# EAGLE design untitled (EAGLE 9.5.2)
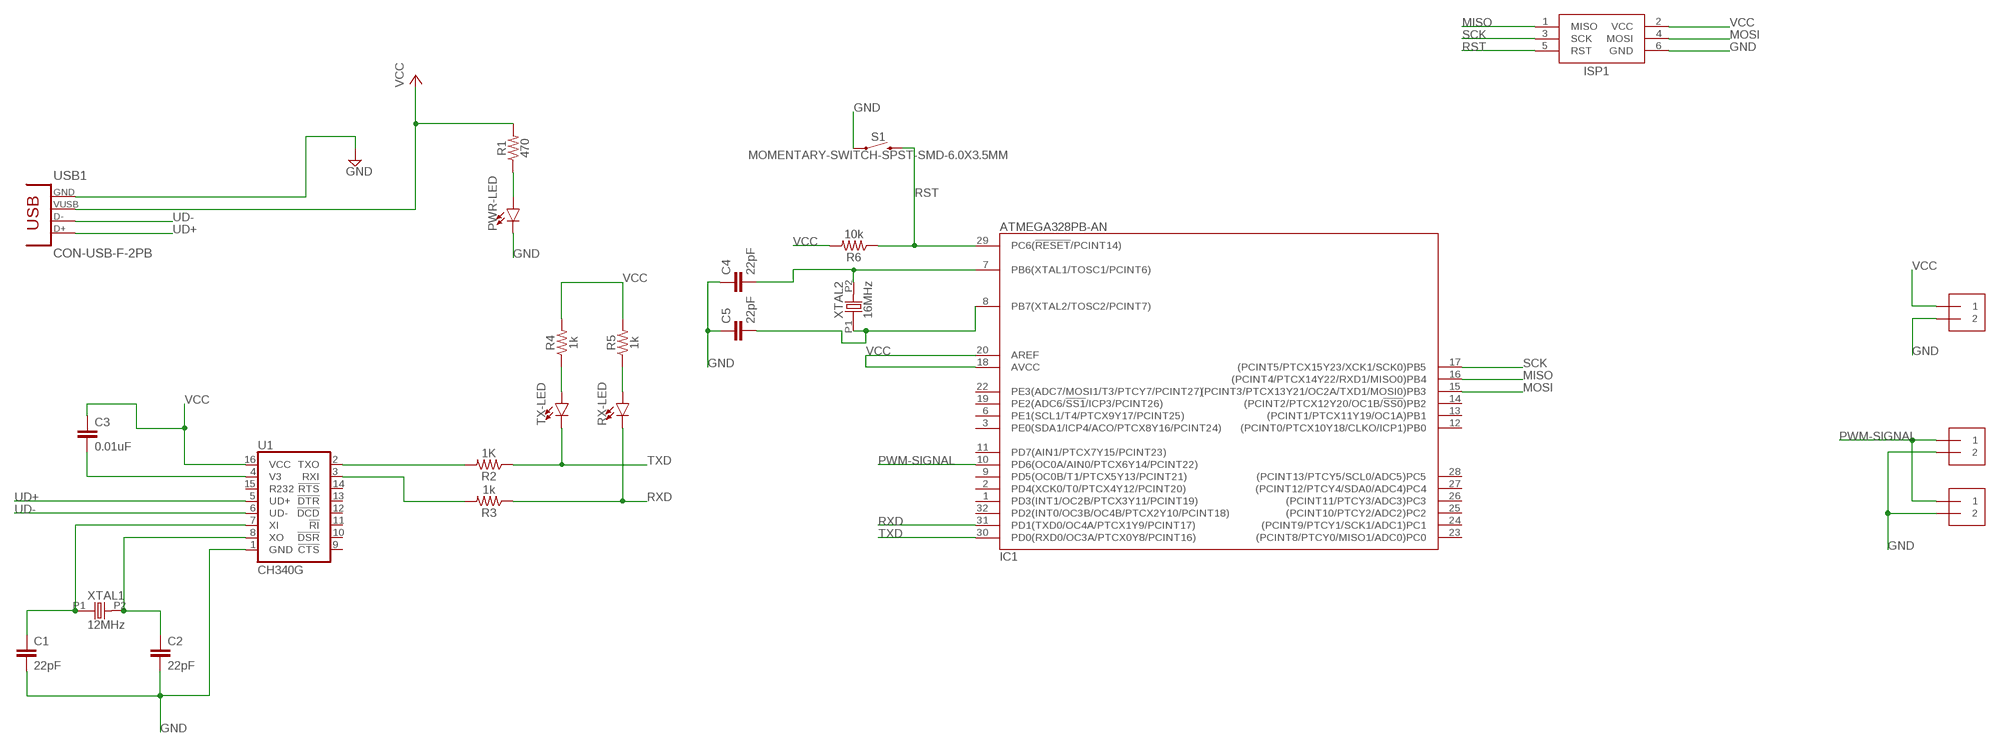
[diagram p0: schematic, sheet 1]

## Parts
5V/GND  1X2-3.5MM  [1X2-3.5MM]
C1  22pF  22PF-0603-50V-5%  [0603]
C2  22pF  22PF-0603-50V-5%  [0603]
C3  0.01uF  22PF-0603-50V-5%  [0603]
C4  22pF  22PF-0603-50V-5%  [0603]
C5  22pF  22PF-0603-50V-5%  [0603]
IC1  ATMEGA328PB-AN  [QFP32_7X7_0.80]
ISP1  AVRISP-6  [AVRISP]
MOTOR-1  1X2-3.5MM  [1X2-3.5MM]
MOTOR-2  1X2-3.5MM  [1X2-3.5MM]
PWR-LED  LED1206  [LED-1206]
R1  470  RESISTOR1206  [1206]
R2  1K  RESISTOR1206  [1206]
R3  1k  RESISTOR1206  [1206]
R4  1k  RESISTOR1206  [1206]
R5  1k  RESISTOR1206  [1206]
R6  10k  RESISTOR1206  [1206]
RX-LED  LED1206  [LED-1206]
S1  MOMENTARY-SWITCH-SPST-SMD-6.0X3.5MM  [TACTILE_SWITCH_SMD_6.0X3.5MM]
TX-LED  LED1206  [LED-1206]
U1  CH340G  CH340GSMD  [SO016]
USB1  CON-USB-F-2PB  [CONN_USB_A_F]
XTAL1  12MHz  OSC-XTAL-HC-49U-PTH  [HC-49U-PTH]
XTAL2  16MHz  OSC-XTAL-HC-49U-PTH  [HC-49U-PTH]

## Nets
GND: 5V/GND.2 C1.2 C2.2 C4.1 C5.1 ISP1.6(GND) MOTOR-1.2 MOTOR-2.2 PWR-LED.C S1.1 U1.1(GND) USB1.4(GND)
MISO: IC1.16((PCINT4/PTCX14Y22/RXD1/MISO0)PB4) ISP1.1(MISO)
MOSI: IC1.15((PCINT3/PTCX13Y21/OC2A/TXD1/MOSI0)PB3) ISP1.4(MOSI)
N$1: PWR-LED.A R1.1
N$2: C2.1 U1.8(XO) XTAL1.P2
N$3: C1.1 U1.7(XI) XTAL1.P1
N$4: C3.2 U1.4(V3)
N$5: R4.1 TX-LED.A
N$6: R2.2 U1.2(TXO)
N$7: R3.2 U1.3(RXI)
N$9: C4.2 IC1.7(PB6(XTAL1/TOSC1/PCINT6)) XTAL2.P2
N$10: C5.2 IC1.8(PB7(XTAL2/TOSC2/PCINT7)) XTAL2.P1
N$11: R5.1 RX-LED.A
PWM-SIGNAL: IC1.10(PD6(OC0A/AIN0/PTCX6Y14/PCINT22)) MOTOR-1.1 MOTOR-2.1
RST: IC1.29(PC6(!RESET!/PCINT14)) ISP1.5(RST) R6.1 S1.2
RXD: IC1.31(PD1(TXD0/OC4A/PTCX1Y9/PCINT17)) R3.1 RX-LED.C
SCK: IC1.17((PCINT5/PTCX15Y23/XCK1/SCK0)PB5) ISP1.3(SCK)
TXD: IC1.30(PD0(RXD0/OC3A/PTCX0Y8/PCINT16)) R2.1 TX-LED.C
UD+: U1.5(UD+) USB1.3(D+)
UD-: U1.6(UD-) USB1.2(D-)
VCC: 5V/GND.1 C3.1 IC1.18(AVCC) IC1.20(AREF) ISP1.2(VCC) R1.2 R4.2 R5.2 R6.2 U1.16(VCC) USB1.1(VUSB)
Unconnected: IC1.1(PD3(INT1/OC2B/PTCX3Y11/PCINT19)) IC1.2(PD4(XCK0/T0/PTCX4Y12/PCINT20)) IC1.3(PE0(SDA1/ICP4/ACO/PTCX8Y16/PCINT24)) IC1.6(PE1(SCL1/T4/PTCX9Y17/PCINT25)) IC1.9(PD5(OC0B/T1/PTCX5Y13/PCINT21)) IC1.11(PD7(AIN1/PTCX7Y15/PCINT23)) IC1.12((PCINT0/PTCX10Y18/CLKO/ICP1)PB0) IC1.13((PCINT1/PTCX11Y19/OC1A)PB1) IC1.14((PCINT2/PTCX12Y20/OC1B/!SS0!)PB2) IC1.19(PE2(ADC6/!SS1!/ICP3/PCINT26)) IC1.22(PE3(ADC7/MOSI1/T3/PTCY7/PCINT27)) IC1.23((PCINT8/PTCY0/MISO1/ADC0)PC0) IC1.24((PCINT9/PTCY1/SCK1/ADC1)PC1) IC1.25((PCINT10/PTCY2/ADC2)PC2) IC1.26((PCINT11/PTCY3/ADC3)PC3) IC1.27((PCINT12/PTCY4/SDA0/ADC4)PC4) IC1.28((PCINT13/PTCY5/SCL0/ADC5)PC5) IC1.32(PD2(INT0/OC3B/OC4B/PTCX2Y10/PCINT18)) U1.9(!CTS) U1.10(!DSR) U1.11(!RI) U1.12(!DCD) U1.13(!DTR) U1.14(!RTS) U1.15(R232) USB1.B1(BODY) USB1.B2(BODY)

## Power pins joined to a net without a drawn wire
GND: IC1.5(GND) IC1.21(GND)
VCC: IC1.4(VCC)

## Library data of the parts
5V/GND MOTOR-1 MOTOR-2 = adafruit:1X2: 3.5mm Terminal block http://www.ladyada.net/library/pcb/eaglelibrary.html
C1 C2 C4 C5 = SparkFun-Capacitors:22PF: 22pF ceramic capacitors A capacitor is a passive two-terminal electrical component used to store electrical energy temporarily in an electric field.; PROD_ID: CAP-07876
C3 = SparkFun-Capacitors:22PF: 22pF ceramic capacitors A capacitor is a passive two-terminal electrical component used to store electrical energy temporarily in an electric field.; PROD_ID: CAP-07876; VALUE: 22pF
IC1 = atmel:ATMEGA328PB: 8-bit AVR Microcontroller 32kbytes flash 2kbytes SRAM 1kbyte EEPROM USART 8-channel 10 bit ADC
ISP1 = adafruit:AVRISP: AVR ISP HEADER Standard 6 pin header for AVR programming
PWR-LED RX-LED TX-LED = SparkFun-LED:LED: LED (Generic) Standard schematic elements and footprints for 5mm, 3mm, 1206, and 0603 sized LEDs. Generic LEDs with no color specified.
R1-R6 = SparkFun-Resistors:RESISTOR: Generic Resistor Package
S1 = SparkFun-Switches:MOMENTARY-SWITCH-SPST: Momentary Switch (Pushbutton) - SPST Normally-open (NO) SPST momentary switches (buttons, pushbuttons). Variants PTH-12MM - 12mm square, through-hole Momentary Pushbutton Switch - 12mm Square <https://www.sparkfun.com/products/9190> (COM-09190) PTH-6.0MM, PTH-6.0MM-KIT - 6.0mm square, through-hole Mini Pushbutton Switch <https://www.sparkfun.com/products/97> (COM-00097) KIT package intended for soldering kit's - only one side of pads' copper is exposed. PTH-RIGHT-ANGLE-KIT - Right-angle, through-hole Right Angle Tactile Button <https://www.sparkfun.com/products/10791> - Used on SparkFun BigTime Watch Kit <https://www.sparkfun.com/products/11734> SMD-12MM - 12mm square, surface-mount Tactile Button - SMD (12mm) <https://www.sparkfun.com/products/12993> (COM-12993) Used on SparkFun PicoBoard <https://www.sparkfun.com/products/11888> SMD-4.5MM - 4.5mm Square Trackball Switch Used on SparkFun Blackberry Trackballer Breakout <https://www.sparkfun.com/products/13169> SMD-4.6MMX2.8MM - 4.60mm x 2.80mm, surface mount Used on SparkFun SAMD21 Mini Breakout <https://www.sparkfun.com/products/13664> SMD-5.2MM, SMD-5.2-REDUNDANT - 5.2mm square, surface-mount Mini Pushbutton Switch - SMD <https://www.sparkfun.com/products/8720> (COM-08720) Used on Arduino Pro Mini <https://www.sparkfun.com/products/11114> REDUNDANT package connects both switch circuits together SMD-6.0X3.5MM - 6.0 x 3.5mm, surface mount Momentary Reset Switch SMD <https://www.sparkfun.com/products/8229> (COM-08229) SMD-6.2MM-TALL - 6.2mm square, surface mount Tactile Button - SMD (6mm) <https://www.sparkfun.com/products/12992> Used on SparkFun Digital Sandbox <https://www.sparkfun.com/products/12651> SMD-RIGHT-ANGLE - Right-angle, surface mount Used on SparkFun Block for Intel® Edison - Arduino <https://www.sparkfun.com/products/13036>; PROD_ID: SWCH-14278; SF_SKU: COM-08229
U1 = SparkFun-IC-Comms:CH340G: A simple USB 2.0 to Serial IC.; PROD_ID: IC-13498
USB1 = dp_devices:CON-USB-F-2PB: USB Female connector with 2 body pins
XTAL1 XTAL2 = dp_devices:OSC-XTAL

## Board
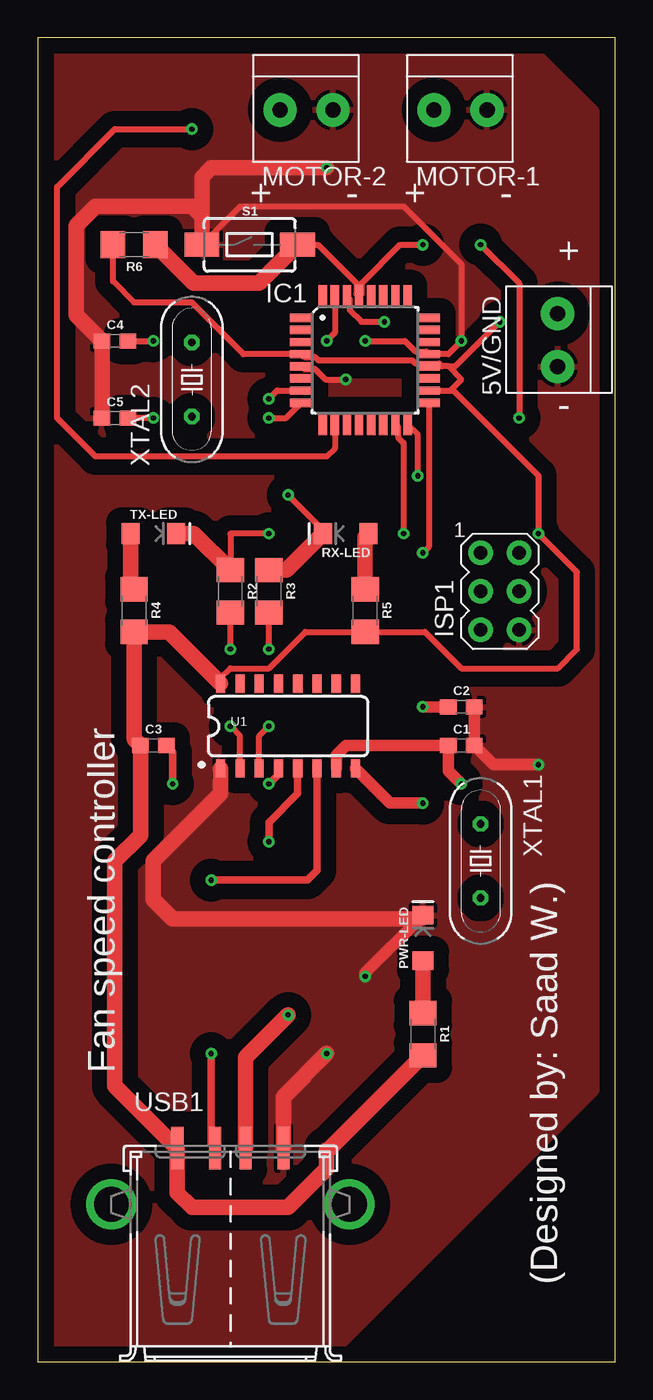
[diagram p1: board, top side]
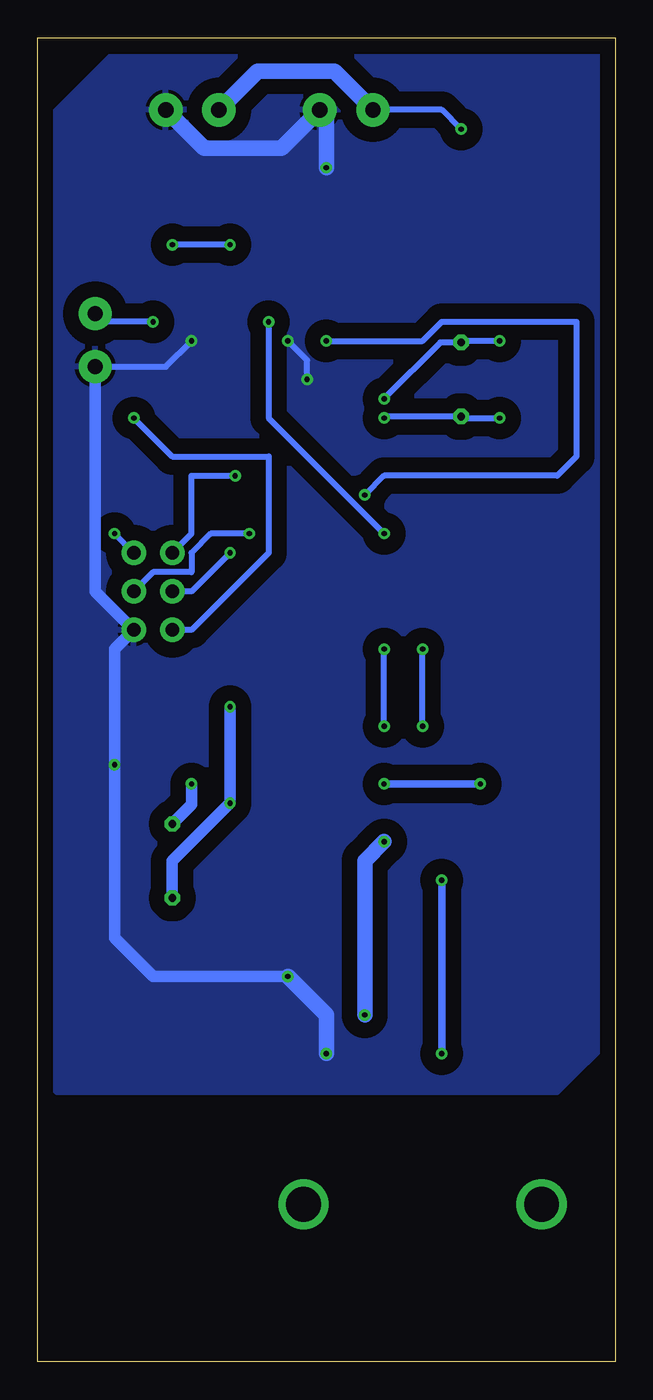
[diagram p2: board, bottom side, seen from below]

Size 38.08 x 87.3 mm. Coordinates in mm from the lower left corner, seen from the top.
Outline: 0,0 38.08,0 38.08,87.3 0,87.3 0,0
Copper layers (1*16): Top 0.035mm / dielectric 1.5mm / Bottom 0.035mm
Design rules "default": minimum track width 6mil, minimum drill 0.35mm, track to track 6mil, track to pad 6mil, pad to pad 6mil, via to via 6mil, smd to smd 6mil, copper to edge 40mil, drill to drill 6mil, minimum pad ring 10mil, minimum via ring 8mil, stop-mask expansion 4mil, vias tented up to drill 0mil, thermal gap 10mil

### Footprints (pad centres in the part's own frame; a part is rotated, then mirrored left to right if it is on the bottom)
1X2-3.5MM = drill 1 pad 2.184: 1 1.8,0; 2 -1.7,0
0603 = smd 1.1 x 1: 1 -0.85,0; 2 0.85,0
QFP32_7X7_0.80 = smd 1.5 x 0.55: 1 -4.2,2.8; 2 -4.2,2; 3 -4.2,1.2; 4 -4.2,0.4; 5 -4.2,-0.4; 6 -4.2,-1.2; 7 -4.2,-2; 8 -4.2,-2.8; 17 4.2,-2.8; 18 4.2,-2; 19 4.2,-1.2; 20 4.2,-0.4; 21 4.2,0.4; 22 4.2,1.2; 23 4.2,2; 24 4.2,2.8 | smd 0.55 x 1.5: 9 -2.8,-4.2; 10 -2,-4.2; 11 -1.2,-4.2; 12 -0.4,-4.2; 13 0.4,-4.2; 14 1.2,-4.2; 15 2,-4.2; 16 2.8,-4.2; 25 2.8,4.2; 26 2,4.2; 27 1.2,4.2; 28 0.4,4.2; 29 -0.4,4.2; 30 -1.2,4.2; 31 -2,4.2; 32 -2.8,4.2
AVRISP = drill 0.9 pad 1.626: 1 -1.27,2.54; 2 1.27,2.54; 3 -1.27,0; 4 1.27,0; 5 -1.27,-2.54; 6 1.27,-2.54
LED-1206 = smd 1.2 x 1.4: A -1.5,0; C 1.5,0
1206 = smd 1.6 x 1.8: 1 -1.4,0; 2 1.4,0
TACTILE_SWITCH_SMD_6.0X3.5MM = smd 2.3 x 1.6: 1 -3.15,0; 2 3.15,0
SO016 = smd 0.6 x 1.2: 1 -4.445,-2.8; 2 -3.175,-2.8; 3 -1.905,-2.8; 4 -0.635,-2.8; 5 0.635,-2.8; 6 1.905,-2.8; 7 3.175,-2.8; 8 4.445,-2.8; 9 4.445,2.8; 10 3.175,2.8; 11 1.905,2.8; 12 0.635,2.8; 13 -0.635,2.8; 14 -1.905,2.8; 15 -3.175,2.8; 16 -4.445,2.8
CONN_USB_A_F = smd 0.8 x 2.82: 1 -3.5,6.46; 2 -1,6.46; 3 1,6.46; 4 3.5,6.46 | drill 2.3: B1 -7.85,2.75; B2 7.85,2.75
HC-49U-PTH = drill 0.508 octagon: P1 -2.44,0; P2 2.44,0

### Placement (x,y rotation side)
5V/GND  34.29,67.31 90 top
C1  27.94,40.64 0 top
C2  27.94,43.18 0 top
C3  7.62,40.64 0 top
C4  5.08,67.31 0 top
C5  5.08,62.23 0 top
IC1  21.59,66.04 0 top
ISP1  30.48,50.8 0 top
MOTOR-1  27.94,82.55 180 top
MOTOR-2  17.78,82.55 180 top
PWR-LED  25.4,27.94 90 top
R1  25.4,21.59 270 top
R2  12.7,50.8 270 top
R3  15.24,50.8 270 top
R4  6.35,49.53 270 top
R5  21.59,49.53 270 top
R6  6.35,73.66 180 top
RX-LED  20.32,54.61 180 top
S1  13.97,73.66 0 top
TX-LED  7.62,54.61 0 top
U1  16.51,41.91 0 top
USB1  12.7,7.62 0 top
XTAL1  29.21,33.02 270 top
XTAL2  10.16,64.77 90 top

### Tracks (layer width: path | path; a pad name or v marks a point on that pad's centre or on a via)
GND  (via drill 0.35)
  Top 0.381: IC1.5 17.57,65.46 18.28,65.46 18.97,64.77 v20.32,64.77 | v21.59,67.31 24.21,67.31 24.9,66.62 25.61,66.62 IC1.21 27.07,66.44 v27.94,67.31 27.94,72.39 24.13,76.2 13.36,76.2 S1.1
  Top 0.762: 25.17,29.21 21.59,25.63 v21.59,25.4 | v33.02,39.37 30.06,39.37 C1.2 C2.2
  Top 1.016: PWR-LED.C 25.17,29.21 8.89,29.21 7.62,30.48 7.62,33.02 12.07,37.47 U1.1 | C5.1 C4.1 2.54,69 2.54,74.93 3.81,76.2 10.16,76.2 10.82,75.54 S1.1 10.82,78.13 11.43,78.74 v19.05,78.74 | USB1.4 16.2,17.47 v19.05,20.32
  Bottom 0.381: 5V/GND.2 29.64,65.61 v27.94,67.31 | v20.32,64.77 20.32,66.04 v21.59,67.31
  Bottom 0.762: v21.59,25.4 30.48,25.4 33.02,27.94 v33.02,39.37 33.02,46.99 ISP1.6 34.29,50.8 5V/GND.2
  Bottom 1.016: MOTOR-1.2 27.1,80.01 22.02,80.01 MOTOR-2.2 19.05,82.12 v19.05,78.74 | v19.05,20.32 19.05,22.86 v21.59,25.4
  pour Bottom (isolate 1.016): 0,86.36 33.02,86.36 38.1,81.28 38.1,19.05 36.83,17.78 3.81,17.78 0,21.59
  pour Top (isolate 1.016): 1.27,86.36 33.02,86.36 36.83,82.55 36.83,17.78 19.05,0 1.27,0
MISO  (via drill 0.35)
  Top 0.381: v25.07,58.42 25.07,61.16 IC1.16
  Bottom 0.381: ISP1.1 27.94,54.61 27.94,58.42 v25.07,58.42
MOSI  (via drill 0.35)
  Top 0.381: IC1.15 23.77,61.66 23.77,60.95 24.13,60.59 v24.13,54.61
  Bottom 0.381: v24.13,54.61 26.67,54.61 27.94,53.34 27.94,52.07 30.48,52.07 ISP1.4
N$1
  Top 1.016: PWR-LED.A R1.1
N$2  (via drill 0.35)
  Top 0.762: v25.4,36.83 23.23,36.83 U1.8 | v25.4,43.18 C2.1
  Bottom 0.762: XTAL1.P2 29.21,33.02 v25.4,36.83 v25.4,43.18
N$3  (via drill 0.35)
  Top 0.762: v27.94,38.1 27.09,38.95 C1.1 20.32,40.64 19.68,40.01 U1.7
  Bottom 0.762: XTAL1.P1 27.94,36.73 v27.94,38.1
N$4  (via drill 0.35)
  Top 0.508: C3.2 8.89,40.22 v8.89,38.1 | v15.24,38.1 15.88,38.73 U1.4
  Bottom 0.508: v8.89,38.1 v15.24,38.1
N$5
  Top 1.016: R4.1 6.12,51.16 TX-LED.A
N$6  (via drill 0.35)
  Top 0.381: U1.2 13.34,41.27 v12.7,41.91 | v12.7,46.99 R2.2
  Bottom 0.381: v12.7,41.91 v12.7,46.99
N$7  (via drill 0.35)
  Top 0.381: U1.3 14.61,41.27 v15.24,41.91 | v15.24,46.99 R3.2
  Bottom 0.381: v15.24,41.91 v15.24,46.99
N$9  (via drill 0.35)
  Top 0.381: C4.2 v7.62,67.31 | v15.24,63.5 15.78,64.04 IC1.7
  Bottom 0.381: v7.62,67.31 10.06,67.31 XTAL2.P2 11.53,67.21 v15.24,63.5
N$10  (via drill 0.35)
  Top 0.381: v7.62,62.23 C5.2 | v15.24,62.23 16.38,62.23 IC1.8
  Bottom 0.381: v7.62,62.23 10.06,62.23 XTAL2.P1 15.14,62.33 v15.24,62.23
N$11
  Top 1.016: RX-LED.A 21.59,54.38 R5.1
PWM-SIGNAL  (via drill 0.35)
  Top 0.381: IC1.10 19.59,60.23 19.05,59.69 3.81,59.69 1.27,62.23 1.27,77.47 5.08,81.28 v10.16,81.28
  Bottom 0.381: v10.16,81.28 11.43,82.55 MOTOR-2.1
  Bottom 1.016: MOTOR-2.1 18.52,85.09 23.6,85.09 MOTOR-1.1
RST  (via drill 0.35)
  Top 0.381: S1.2 18.48,73.66 21.01,71.13 21.01,70.42 IC1.29 21.37,70.42 21.37,71.13 23.9,73.66 v25.4,73.66 | v29.21,73.66 31.75,71.12 v31.75,62.23
  Top 1.016: R6.1 10.29,71.12 14.58,71.12 S1.2
  Bottom 0.381: v25.4,73.66 v29.21,73.66 | v31.75,62.23 29.21,59.69 22.86,59.69 22.86,53.34 27.94,48.26 ISP1.5
RXD  (via drill 0.35)
  Top 0.381: IC1.31 19.59,67.85 v19.05,67.31 | v16.51,57.15 18.82,54.84 RX-LED.C
  Top 1.016: RX-LED.C 16.41,52.2 R3.1
  Bottom 0.381: v16.51,57.15 15.24,58.42 3.81,58.42 2.54,59.69 2.54,68.58 11.43,68.58 12.7,67.31 v19.05,67.31
SCK  (via drill 0.35)
  Top 0.381: IC1.17 25.79,53.73 v25.4,53.34
  Bottom 0.381: v25.4,53.34 27.94,50.8 ISP1.3
TXD  (via drill 0.35)
  Top 0.381: IC1.30 20.57,70.06 20.57,69.35 21.34,68.58 v22.86,68.58 | v15.24,54.61 12.7,54.61 R2.1
  Top 1.016: TX-LED.C 10.29,54.61 R2.1
  Bottom 0.381: v15.24,54.61 22.86,62.23 v22.86,68.58
UD+  (via drill 0.35)
  Top 0.508: v15.24,34.29 15.24,35.56 17.14,37.47 U1.5
  Top 1.016: USB1.3 13.7,20.05 v16.51,22.86
  Bottom 1.016: v16.51,22.86 16.51,33.02 v15.24,34.29
UD-  (via drill 0.35)
  Top 0.508: U1.6 18.41,32.38 17.78,31.75 v11.43,31.75 | v11.43,20.32 11.43,14.35 USB1.2
  Bottom 0.508: v11.43,31.75 v11.43,20.32
VCC  (via drill 0.35)
  Top 0.381: 27.07,65.64 27.94,64.77 27.21,64.04 IC1.18 27.4,64.04 33.02,58.42 v33.02,54.61 35.56,52.07 35.56,46.99 34.29,45.72 27.94,45.72 25.53,48.13 R5.2 17.65,48.13 15.24,45.72 12.7,45.72 12.07,45.09 U1.16 | 27.07,65.64 26.67,65.64 | IC1.20 26.67,65.64 | 27.07,65.64 27.54,65.64 v30.48,68.58 | 26.67,65.64 26.49,65.82 24.9,65.82 24.68,66.04 18.5,66.04 18.28,66.26 17.57,66.26 IC1.4 13.57,66.44 10.16,69.85 6.35,69.85 4.95,71.25 R6.2
  Top 1.016: R1.2 19.18,13.97 19.05,13.97 19.05,12.7 16.51,10.16 10.16,10.16 9.2,11.12 USB1.1 5.08,18.2 5.08,33.02 6.77,34.71 C3.1 6.35,41.06 R4.2 8.64,48.13 U1.16
  Bottom 0.381: v30.48,68.58 33.76,68.58 5V/GND.1 | v33.02,54.61 ISP1.2

### Text on the board
tPlace: + | - | + | - | + | - | Fan speed controller | (Designed by: Saad W.)